# EAGLE schematic zeta2rework_lw_v4 (EAGLE 9.0.1)
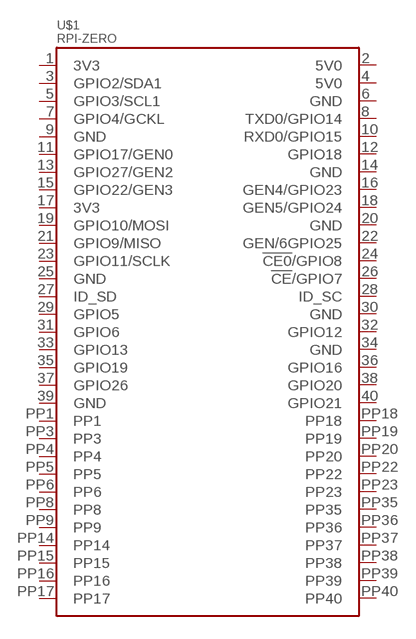
[diagram p0: schematic, sheet 1, part 1 of 2]
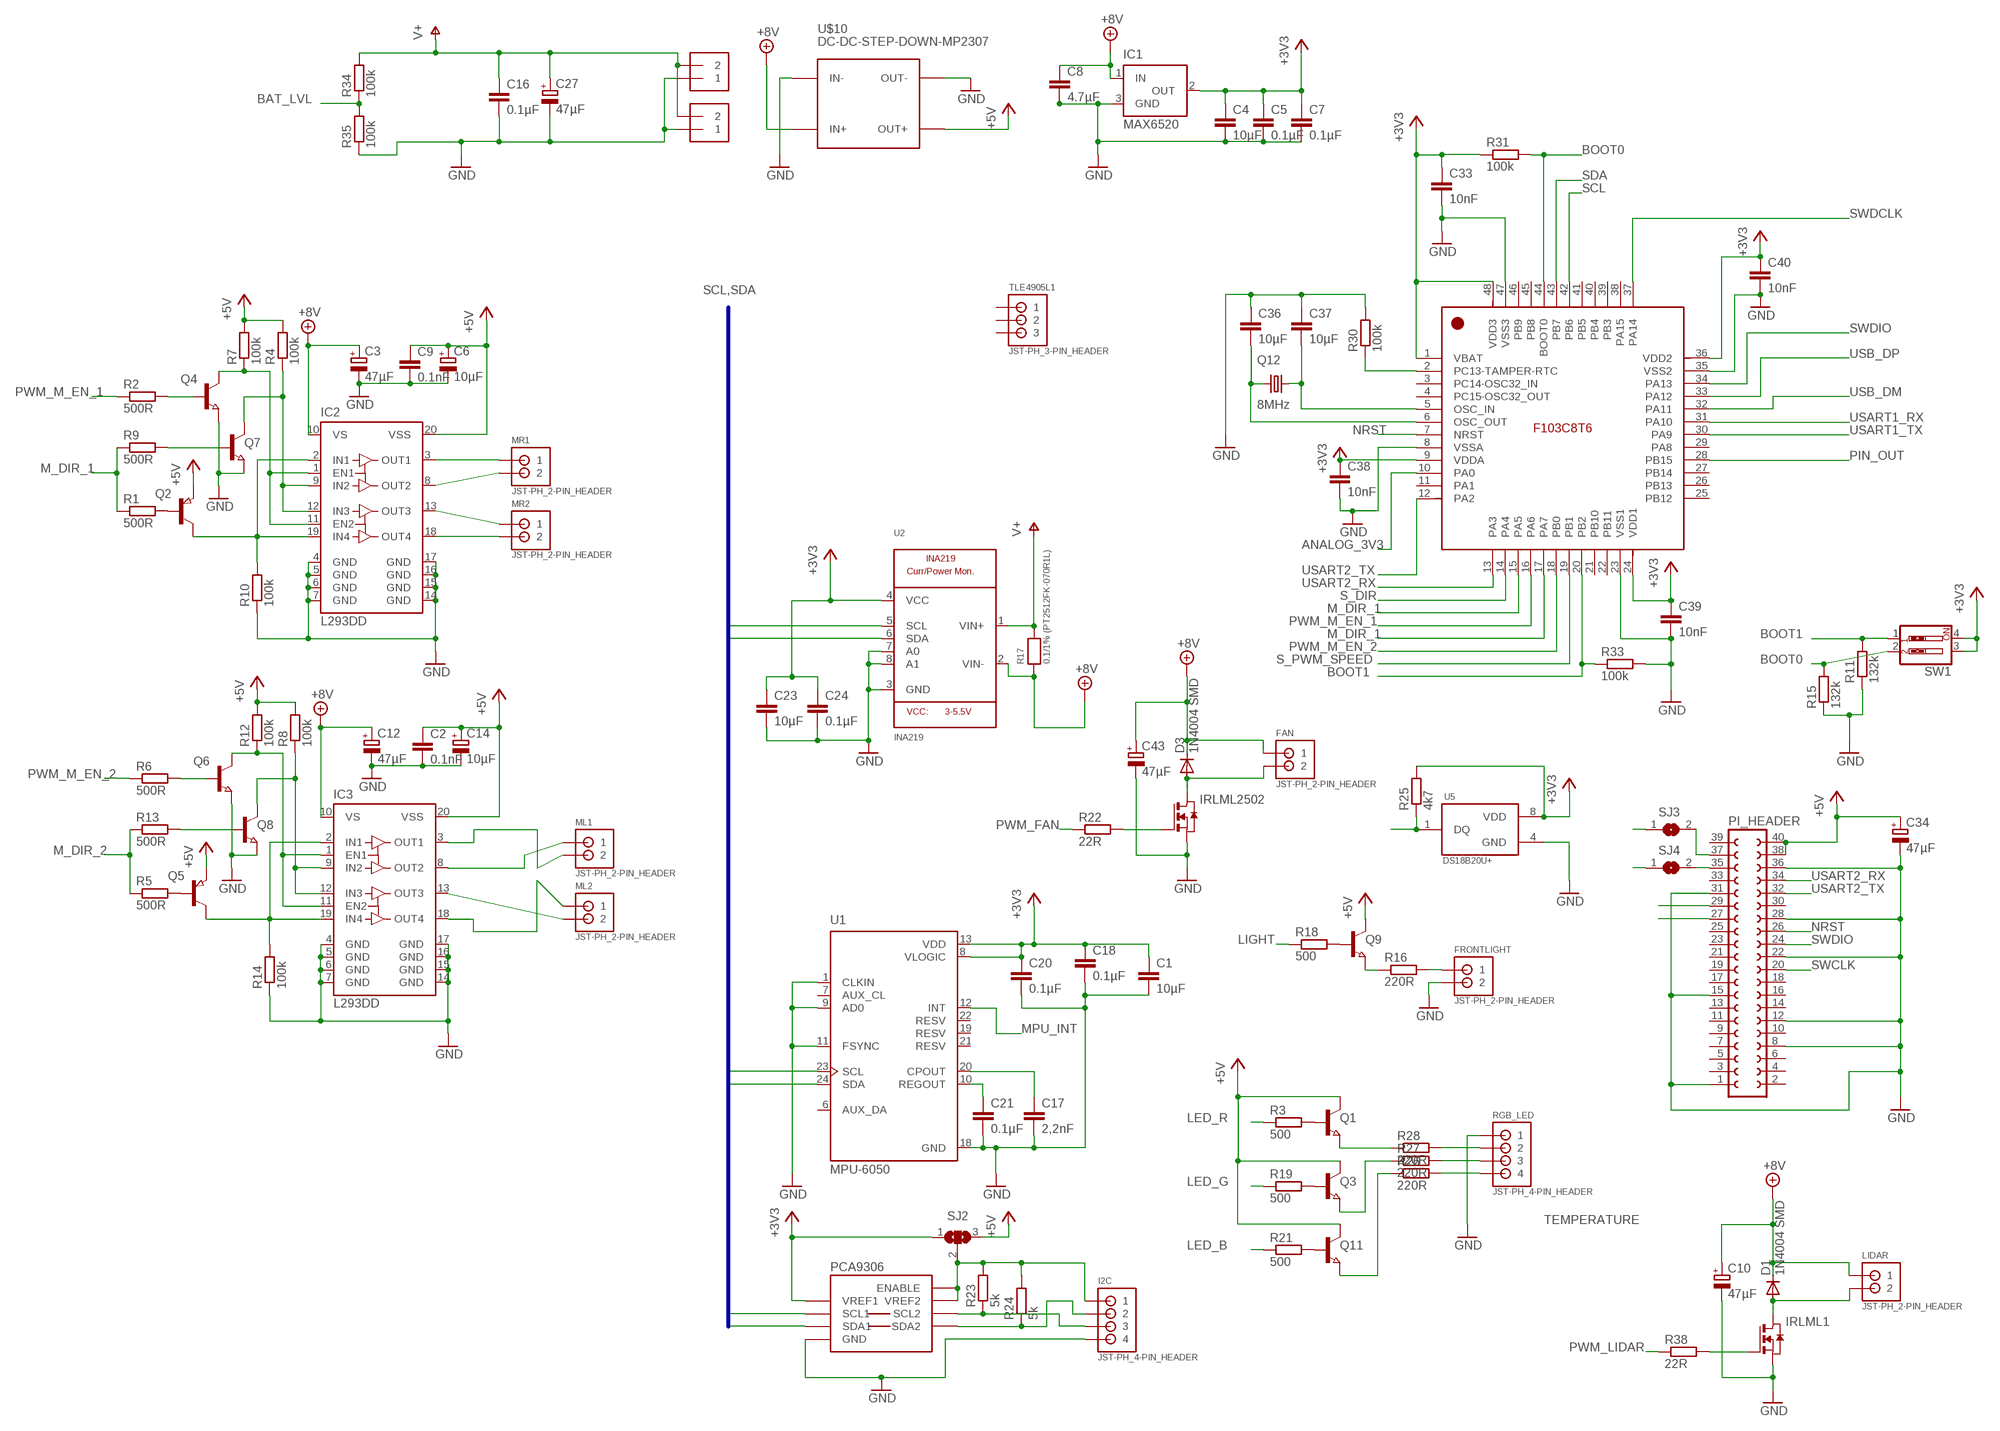
[diagram p1: schematic, sheet 1, part 2 of 2]

## Parts
C1  10µF  C-EUC1206  [C1206]
C2  0.1nF  C-EUC1206  [C1206]
C3  47µF  CPOL-EUUD-4X5,8  [UD-4X5,8_NICHICON]
C4  10µF  C-EUC1206  [C1206]
C5  0.1µF  C-EUC1206  [C1206]
C6  10µF  CPOL-EUUD-4X5,8  [UD-4X5,8_NICHICON]
C7  0.1µF  C-EUC1206  [C1206]
C8  4.7µF  C-EUC1206  [C1206]
C9  0.1nF  C-EUC1206  [C1206]
C10  47µF  CPOL-EUUD-4X5,8  [UD-4X5,8_NICHICON]
C12  47µF  CPOL-EUUD-4X5,8  [UD-4X5,8_NICHICON]
C14  10µF  CPOL-EUUD-4X5,8  [UD-4X5,8_NICHICON]
C16  0.1µF  C-EUC1206  [C1206]
C17  2,2nF  C-EUC1206  [C1206]
C18  0.1µF  C-EUC1206  [C1206]
C20  0.1µF  C-EUC1206  [C1206]
C21  0.1µF  C-EUC1206  [C1206]
C23  10µF  C-EUC1206  [C1206]
C24  0.1µF  C-EUC1206  [C1206]
C27  47µF  CPOL-EUUD-4X5,8  [UD-4X5,8_NICHICON]
C33  10nF  C-EUC1206  [C1206]
C34  47µF  CPOL-EUUD-4X5,8  [UD-4X5,8_NICHICON]
C36  10µF  C-EUC1206  [C1206]
C37  10µF  C-EUC1206  [C1206]
C38  10nF  C-EUC1206  [C1206]
C39  10nF  C-EUC1206  [C1206]
C40  10nF  C-EUC1206  [C1206]
C43  47µF  CPOL-EUUD-4X5,8  [UD-4X5,8_NICHICON]
D1  1N4004 SMD  DIODE-MELF-MLL41  [MELF-MLL41]
D3  1N4004 SMD  DIODE-MELF-MLL41  [MELF-MLL41]
FAN  JST-PH_2-PIN_HEADER  [JST_B2B-PH_HEADER]
FRONTLIGHT  JST-PH_2-PIN_HEADER  [JST_B2B-PH_HEADER]
I2C  JST-PH_4-PIN_HEADER  [JST_B4B-PH_HEADER]
IC1  MAX6520  [SOT23]
IC2  L293DD  [SO20]
IC3  L293DD  [SO20]
IRLML1  NMOSSOT23  [SOT-23]
IRLML2502  NMOSSOT23  [SOT-23]
LIDAR  JST-PH_2-PIN_HEADER  [JST_B2B-PH_HEADER]
ML1  JST-PH_2-PIN_HEADER  [JST_B2B-PH_HEADER]
ML2  JST-PH_2-PIN_HEADER  [JST_B2B-PH_HEADER]
MR1  JST-PH_2-PIN_HEADER  [JST_B2B-PH_HEADER]
MR2  JST-PH_2-PIN_HEADER  [JST_B2B-PH_HEADER]
PCA9306  IC2_LEVEL_TRANSLATER  [SOIC-8]
PI_HEADER  FE20-2  [FE20-2]
Q1  NPN-TRANSISTOR_SOT23  [SOT23]
Q2  PNP-TRANSISTOR_SOT23  [SOT23]
Q3  NPN-TRANSISTOR_SOT23  [SOT23]
Q4  NPN-TRANSISTOR_SOT23  [SOT23]
Q5  PNP-TRANSISTOR_SOT23  [SOT23]
Q6  NPN-TRANSISTOR_SOT23  [SOT23]
Q7  NPN-TRANSISTOR_SOT23  [SOT23]
Q8  NPN-TRANSISTOR_SOT23  [SOT23]
Q9  NPN-TRANSISTOR_SOT23  [SOT23]
Q11  NPN-TRANSISTOR_SOT23  [SOT23]
Q12  8MHz  KX-13  [7.0X5.0]
R1  500R  R-EU_R0603  [R0603]
R2  500R  R-EU_R0603  [R0603]
R3  500  R-EU_R1206  [R1206]
R4  100k  R-EU_R0603  [R0603]
R5  500R  R-EU_R0603  [R0603]
R6  500R  R-EU_R0603  [R0603]
R7  100k  R-EU_R0603  [R0603]
R8  100k  R-EU_R0603  [R0603]
R9  500R  R-EU_R0603  [R0603]
R10  100k  R-EU_R0603  [R0603]
R11  132k  R-EU_R0603  [R0603]
R12  100k  R-EU_R0603  [R0603]
R13  500R  R-EU_R0603  [R0603]
R14  100k  R-EU_R0603  [R0603]
R15  132k  R-EU_R0603  [R0603]
R16  220R  R-EU_R0603  [R0603]
R17  0.1/1% (PT2512FK-070R1L)  RESISTOR2512  [2512]
R18  500  R-EU_R1206  [R1206]
R19  500  R-EU_R1206  [R1206]
R21  500  R-EU_R0603  [R0603]
R22  22R  R-EU_R0603  [R0603]
R23  5k  R-EU_R0603  [R0603]
R24  5k  R-EU_R0603  [R0603]
R25  4k7  R-EU_R0603  [R0603]
R26  220R  R-EU_R0603  [R0603]
R27  220R  R-EU_R0603  [R0603]
R28  220R  R-EU_R0603  [R0603]
R30  100k  R-EU_R0603  [R0603]
R31  100k  R-EU_R0603  [R0603]
R33  100k  R-EU_R0603  [R0603]
R34  100k  R-EU_R0603  [R0603]
R35  100k  R-EU_R0603  [R0603]
R38  22R  R-EU_R0603  [R0603]
RGB_LED  JST-PH_4-PIN_HEADER  [JST_B4B-PH_HEADER]
SJ2  SJ2W  [SJ_2]
SJ3  SOLDERJUMPERREFLOW_NOPASTE  [SOLDERJUMPER_REFLOW_NOPASTE]
SJ4  SOLDERJUMPERREFLOW_NOPASTE  [SOLDERJUMPER_REFLOW_NOPASTE]
SUPPLY_IN  TERMBLOCK_1X2-3.5MM  [1X2-3.5MM]
SUPPLY_IN1  TERMBLOCK_1X2-3.5MM  [1X2-3.5MM]
SW1  SW_DIP-2  [EDG-02]
TLE4905L1  JST-PH_3-PIN_HEADER  [JST_B3B-PH_HEADER]
U1  MPU-6050  [QFN50P400X400X95-24N]
U2  INA219  [SOT23-8]
U5  DS18B20U+  [SOP65P490X95-8N]
U$1  RPI-ZERO  [RASP_PI_ZERO_BOARD_FULL]
U$4  STM32F103C8T6  [LQFP48_7X7MM_0.5MMPP]
U$10  DC-DC-STEP-DOWN-MP2307  [DC-DC-STEP-DOWN-MP2307]

## Nets
+3V3: C1.1 C4.1 C5.1 C7.1 C18.1 C20.1 C23.1 C24.1 C33.1 C38.1 C39.1 C40.1 IC1.2(OUT) PCA9306.1(VREF1) R25.2 R31.1 SJ2.1 SW1.3 SW1.4 U1.8(VLOGIC) U1.13(VDD) U2.4(VCC) U5.8(VDD) U$4.1(VBAT) U$4.9(VDDA) U$4.24(VDD1) U$4.36(VDD2) U$4.48(VDD3)
+5V: C2.1 C6.+ C9.1 C14.+ C34.+ IC2.20(VSS) IC3.20(VSS) PI_HEADER.38 PI_HEADER.40 Q1.3(C) Q2.2(E) Q3.3(C) Q5.2(E) Q9.3(C) Q11.3(C) R4.2 R7.2 R8.2 R12.2 SJ2.3 U$10.OUT+
+8V: C3.+ C8.1 C10.+ C12.+ C43.+ D1.C D3.C FAN.P1 IC1.1(IN) IC2.10(VS) IC3.10(VS) LIDAR.P1 R17.1 U2.2(VIN-) U$10.IN+
ANALOG_3V3: U$4.10(PA0)
BAT_LVL: R34.1 R35.2
BOOT0: R15.2 R31.2 SW1.2 U$4.44(BOOT0)
BOOT1: R11.2 R33.1 SW1.1 U$4.20(PB2)
BOOT2: PI_HEADER.29
BOOT3: PI_HEADER.27
GND: C1.2 C2.2 C3.- C4.2 C5.2 C6.- C7.2 C8.2 C9.2 C10.- C12.- C14.- C16.2 C17.2 C18.2 C20.2 C21.2 C23.2 C24.2 C27.- C33.2 C34.- C36.1 C37.1 C38.2 C39.2 C40.2 C43.- FRONTLIGHT.P2 I2C.P4 IC1.3(GND) IC2.4(GND) IC2.5(GND) IC2.6(GND) IC2.7(GND) IC2.14(GND) IC2.15(GND) IC2.16(GND) IC2.17(GND) IC3.4(GND) IC3.5(GND) IC3.6(GND) IC3.7(GND) IC3.14(GND) IC3.15(GND) IC3.16(GND) IC3.17(GND) IRLML1.2(S) IRLML2502.2(S) PCA9306.4(GND) PI_HEADER.1 PI_HEADER.8 PI_HEADER.12 PI_HEADER.15 PI_HEADER.22 PI_HEADER.28 PI_HEADER.31 PI_HEADER.36 Q4.2(E) Q6.2(E) Q7.2(E) Q8.2(E) R10.1 R11.1 R14.1 R15.1 R30.2 R33.2 R35.1 RGB_LED.P1 SUPPLY_IN1.1 SUPPLY_IN.1 U1.1(CLKIN) U1.9(AD0) U1.11(FSYNC) U1.18(GND) U2.3(GND) U2.7(A0) U2.8(A1) U5.4(GND) U$4.8(VSSA) U$4.23(VSS1) U$4.35(VSS2) U$4.47(VSS3) U$10.IN- U$10.OUT-
LED_B: R21.1
LED_G: R19.1
LED_R: R3.1
LIGHT: R18.1
M_DIR_1: R1.1 R9.1 U$4.15(PA5) U$4.17(PA7)
M_DIR_2: R5.1 R13.1
MPU_INT: U1.12(INT)
N$1: IC2.9(IN2) IC2.12(IN3) Q7.3(C) R4.1
N$2: IC3.18(OUT4) ML2.P1
N$3: IC3.13(OUT3) ML2.P2
N$4: IC2.18(OUT4) MR2.P2
N$5: IC2.2(IN1) IC2.19(IN4) Q2.3(C) R10.2
N$6: IC3.9(IN2) IC3.12(IN3) Q8.3(C) R8.1
N$7: IC3.2(IN1) IC3.19(IN4) Q5.3(C) R14.2
N$8: IC2.1(EN1) IC2.11(EN2) Q4.3(C) R7.1
N$9: IC3.1(EN1) IC3.11(EN2) Q6.3(C) R12.1
N$10: Q2.1(B) R1.2
N$11: Q4.1(B) R2.2
N$12: Q7.1(B) R9.2
N$13: Q5.1(B) R5.2
N$14: Q6.1(B) R6.2
N$15: Q8.1(B) R13.2
N$16: IC2.13(OUT3) MR2.P1
N$17: IC2.8(OUT2) MR1.P2
N$18: IC2.3(OUT1) MR1.P1
N$19: Q9.1(B) R18.2
N$20: Q9.2(E) R16.1
N$21: FRONTLIGHT.P1 R16.2
N$22: Q1.1(B) R3.2
N$23: Q3.1(B) R19.2
N$24: Q1.2(E) R28.1
N$25: IC3.8(OUT2) ML1.P1
N$26: IC3.3(OUT1) ML1.P2
N$28: Q3.2(E) R27.1
N$30: Q11.2(E) R26.1
N$31: R26.2 RGB_LED.P4
N$32: Q11.1(B) R21.2
N$33: R27.2 RGB_LED.P3
N$34: C17.1 U1.20(CPOUT)
N$35: R28.2 RGB_LED.P2
N$36: C21.1 U1.10(REGOUT)
N$37: IRLML2502.3(G) R22.2
N$38: IRLML1.3(G) R38.2
N$39: D1.A IRLML1.1(D) LIDAR.P2
N$41: I2C.P1 PCA9306.7(VREF2) PCA9306.8(ENABLE) R23.2 R24.2 SJ2.2
N$42: I2C.P3 PCA9306.6(SCL2) R23.1
N$43: I2C.P2 PCA9306.5(SDA2) R24.1
N$44: PI_HEADER.37 SJ3.2
N$45: PI_HEADER.35 SJ4.2
N$46: C36.2 Q12.1 U$4.6(OSC_OUT)
N$47: C37.2 Q12.3 U$4.5(OSC_IN)
N$49: R30.1 U$4.2(PC13-TAMPER-RTC)
N$55: D3.A FAN.P2 IRLML2502.1(D)
NRST: PI_HEADER.26 U$4.7(NRST)
PIN_OUT: U$4.28(PB15)
PWM_FAN: R22.1
PWM_LIDAR: R38.1
PWM_M_EN_1: R2.1 U$4.16(PA6)
PWM_M_EN_2: R6.1 U$4.18(PB0)
S_DIR: U$4.14(PA4)
S_PWM_SPEED: U$4.19(PB1)
SCL: U1.23(SCL) U2.5(SCL) U$4.42(PB6)
SCL2: PCA9306.2(SCL1)
SCL3: SJ4.1
SDA: U1.24(SDA) U2.6(SDA) U$4.43(PB7)
SDA2: PCA9306.3(SDA1)
SDA3: SJ3.1
SWCLK: PI_HEADER.20
SWDCLK: U$4.37(PA14)
SWDIO: PI_HEADER.24 U$4.34(PA13)
TEMPERATURE: R25.1 U5.1(DQ)
USART1_RX: U$4.31(PA10)
USART1_TX: U$4.30(PA9)
USART2_RX: PI_HEADER.34 U$4.13(PA3)
USART2_TX: PI_HEADER.32 U$4.12(PA2)
USB_DM: U$4.32(PA11)
USB_DP: U$4.33(PA12)
V+: C16.1 C27.+ R17.2 R34.2 SUPPLY_IN1.2 SUPPLY_IN.2 U2.1(VIN+)
Unconnected: PI_HEADER.2 PI_HEADER.3 PI_HEADER.4 PI_HEADER.5 PI_HEADER.6 PI_HEADER.7 PI_HEADER.9 PI_HEADER.10 PI_HEADER.11 PI_HEADER.13 PI_HEADER.14 PI_HEADER.16 PI_HEADER.17 PI_HEADER.18 PI_HEADER.19 PI_HEADER.21 PI_HEADER.23 PI_HEADER.25 PI_HEADER.30 PI_HEADER.33 PI_HEADER.39 TLE4905L1.P1 TLE4905L1.P2 TLE4905L1.P3 U1.6(AUX_DA) U1.7(AUX_CL) U1.19(RESV) U1.21(RESV) U1.22(RESV) U$1.1(3V3) U$1.2(5V0) U$1.3(GPIO2/SDA1) U$1.4(5V0) U$1.5(GPIO3/SCL1) U$1.6(GND) U$1.7(GPIO4/GCKL) U$1.8(TXD0/GPIO14) U$1.9(GND) U$1.10(RXD0/GPIO15) U$1.11(GPIO17/GEN0) U$1.12(GPIO18) U$1.13(GPIO27/GEN2) U$1.14(GND) U$1.15(GPIO22/GEN3) U$1.16(GEN4/GPIO23) U$1.17(3V3) U$1.18(GEN5/GPIO24) U$1.19(GPIO10/MOSI) U$1.20(GND) U$1.21(GPIO9/MISO) U$1.22(GEN/6GPIO25) U$1.23(GPIO11/SCLK) U$1.24(!CE0!/GPIO8) U$1.25(GND) U$1.26(!CE!/GPIO7) U$1.27(ID_SD) U$1.28(ID_SC) U$1.29(GPIO5) U$1.30(GND) U$1.31(GPIO6) U$1.32(GPIO12) U$1.33(GPIO13) U$1.34(GND) U$1.35(GPIO19) U$1.36(GPIO16) U$1.37(GPIO26) U$1.38(GPIO20) U$1.39(GND) U$1.40(GPIO21) U$1.PP1 U$1.PP3 U$1.PP4 U$1.PP5 U$1.PP6 U$1.PP8 U$1.PP9 U$1.PP14 U$1.PP15 U$1.PP16 U$1.PP17 U$1.PP18 U$1.PP19 U$1.PP20 U$1.PP22 U$1.PP23 U$1.PP35 U$1.PP36 U$1.PP37 U$1.PP38 U$1.PP39 U$1.PP40 U$4.3(PC14-OSC32_IN) U$4.4(PC15-OSC32_OUT) U$4.11(PA1) U$4.21(PB10) U$4.22(PB11) U$4.25(PB12) U$4.26(PB13) U$4.27(PB14) U$4.29(PA8) U$4.38(PA15) U$4.39(PB3) U$4.40(PB4) U$4.41(PB5) U$4.45(PB8) U$4.46(PB9)

## Buses
SCL,SDA

## Library data of the parts
C1 C2 C4 C5 C7-C9 C16-C18 C20 C21 C23 C24 C33 C36-C40 = rcl:C-EU: CAPACITOR, European symbol; SPICEPREFIX: C
C3 C6 C10 C12 C14 C27 C34 C43 = rcl:CPOL-EU: POLARIZED CAPACITOR, European symbol; SPICEPREFIX: C
D1 D3 = diode:DIODE-: DIODE
FAN FRONTLIGHT LIDAR ML1 ML2 MR1 MR2 = srg:JST-PH_2-PIN_HEADER: 2-pin JST PH Shrouded Header, top entry P/N B2B-PH-K-S Mating connector PHR-2 Mating cable assembly: Sparkfun PRT-09914 <http://www.sparkfun.com/products/9914>
I2C RGB_LED = srg:JST-PH_4-PIN_HEADER: 4-pin JST PH Shrouded Header, top entry P/N B4B-PH-K-S Mating connector PHR-4 Mating cable assembly: Sparkfun PRT-09916 <http://www.sparkfun.com/products/9916>
IC1 = maxim:MAX6520: 1.2V Voltage Reference 50ppm/°C, SOT23, 3-Terminal Source: Data sheet <http://datasheets.maxim-ic.com/en/ds/MAX6520.pdf>; MF: MAXIM; MPN: MAX6520EUR-T; OC_FARNELL: unknown; OC_NEWARK: 02J4586
IC2 IC3 = st-microelectronics:L293DD: PUSH-PULL FOUR CHANNEL DRIVER WITH DIODES Source: http://www.st.com/stonline/books/pdf/docs/1330.pdf; OC_FARNELL: unknown
IRLML1 IRLML2502 = zetex:NMOSSOT23: MOS FET; OC_FARNELL: unknown; OC_NEWARK: unknown
PCA9306 = srg:IC2_LEVEL_TRANSLATER: I2C Level Translator PCA9306 Data Sheet <http://www.ti.com/lit/ds/symlink/pca9306.pdf> Sparkfun breakout board schematic <http://dlnmh9ip6v2uc.cloudfront.net/datasheets/BreakoutBoards/PCA9306_Breakout.pdf>
PI_HEADER = con-lsta:FE20-2: FEMALE HEADER; OC_FARNELL: unknown; OC_NEWARK: unknown
Q1 Q3 Q4 Q6-Q9 Q11 = semicon-smd-ipc:NPN-TRANSISTOR_: NPN TRANSISTOR
Q2 Q5 = semicon-smd-ipc:PNP-TRANSISTOR_: PNP TRANSISTOR
Q12 = crystal-geyer_V1_0:KX: Quartz Crystals (MHz) SMD: KX - Serie Model Size l/w/h [mm] Frequency Range Frequency Stability Temp. Range [°C] Load Capacitance AECQ 200 availabel Datasheet KX-4 KX-5 KX-6 KX-7 KX-9A KX-9B KX-12A KX-12B KX-13 KX-20 KX-K KX-KS 1.6/1.2/0.3 2.0/1.6/0.45 2.5/2.0/0.55 3.2/2.5/0.8 5.0/3.2/1.0 5.0/3.2/1.1 6.0/3.5/1.1 6.0/3.5/1.0 7.0/5.0 /1.3 11.6/5.5/1.6 12.3/4.5/4.2 12.3/4.5/3.2 24.0 ~ 80.0 MHz 16.0 ~ 80.0 MHz 12.0 ~ 80.0 MHz 8.0 ~ 60.0 MHz 7,68 ~ 300,0 MHz 8,0 ~ 50,0 MHz 8,0 ~ 150,0 MHz 8,0 ~ 50,0 MHz 6,0 ~ 160,0 MHz 3,579 ~ 25,0 MHz 3,579 ~ 70,0 MHz 3,579 ~ 70,0 MHz ±10 … ±50ppm ±10 … ±50ppm ±10 … ±50ppm ±10 … ±50ppm ±10 … ±50ppm ±10 … ±50ppm ±10 … ±50ppm ±10 … ±50ppm ±10 … ±50ppm ±50ppm ±10 … ±50ppm ±10 … ±50ppm (*) -40°C …+85°C (*) -40°C …+125°C (*) -40°C …+125°C (*) -40°C …+125°C (*) -40°C …+105°C (*) -40°C …+105°C (*) -40°C …+125°C (*) -40°C …+105°C (*) -40°C …+105°C (*) -40°C …+105°C (*) -40°C …+85°C (*) -40°C …+85°C 8, 8…16 8, 8…16 10, 8…16 12, 7…20 16, 10…20 16, 10…20 16, 10…20 16, 12…20 16, 12…20 16, 12…20 16, 12…30 16, 12…30 - yes yes yes - - - - - - - - KX-4.pdf <http://www.geyer-electronic.de/uploads/tx_userartikelfrequenz/GEYER-KX-4.pdf> KX-5.pdf <http://www.geyer-electronic.de/uploads/tx_userartikelfrequenz/GEYER-KX-5.pdf> KX-6.pdf <http://www.geyer-electronic.de/uploads/tx_userartikelfrequenz/GEYER-KX-6.pdf> KX-7.pdf <http://www.geyer-electronic.de/uploads/tx_userartikelfrequenz/GEYER-KX-7.pdf> KX-9A.pdf <http://www.geyer-electronic.de/uploads/tx_userartikelfrequenz/GEYER-KX-9A.pdf> KX-9B.pdf <http://www.geyer-electronic.de/uploads/tx_userartikelfrequenz/GEYER-KX-9B.pdf> KX-12A.pdf <http://www.geyer-electronic.de/uploads/tx_userartikelfrequenz/GEYER-KX-12A.pdf> KX-12B.pdf <http://www.geyer-electronic.de/uploads/tx_userartikelfrequenz/GEYER-KX-12B.pdf> KX-13.pdf <http://www.geyer-electronic.de/uploads/tx_userartikelfrequenz/GEYER-KX-13.pdf> KX-20.pdf <http://www.geyer-electronic.de/uploads/tx_userartikelfrequenz/GEYER-KX-20.pdf> KX-K.pdf <http://www.geyer-electronic.de/uploads/tx_userartikelfrequenz/GEYER-KX-K.pdf> KX-KS.pdf <http://www.geyer-electronic.de/uploads/tx_userartikelfrequenz/GEYER-KX-KS.pdf> <http://www.geyer-electronic.de/fileadmin/template/img/logo-geyer-electronic.png> Details see: http://www.geyer-electronic.de/Frequenz-Produkte.9.0.html Created 2016-06-07, Hans Locher 2016 (C) Geyer Quartz Technology KX4,KX5,KX6,KX7,KX9A,KX9B,KX12A,KX12B,KX13,KX20,KXK,KXKS;1612;2016;2520;3225;5032;6035;7050;11655;12345;1,6x1,2;2,0x1,6;2,5x2,0;3,2x2,5;5,0x3,2;6,0x3,5;7,0x5,0;11,6x5,5;12,3x4,5;12,3x4,5;1.6x1.2;2.0x1.6;2.5x2.0;3.2x2.5;5.0x3.2;6.0x3.5;7.0x5.0;11.6x5.5;12.3x4.5;12.3x4.5;
R1-R16 R18 R19 R21-R28 R30 R31 R33-R35 R38 = rcl:R-EU_: RESISTOR, European symbol; SPICEPREFIX: R
R17 = microbuilder:RESISTOR: Resistors 0402 - 0402 Surface Mount Package 22 Ohm 1% 1/16W [Digikey: 311-22.0LRTR-ND] 33 Ohm 5% 1/16W 1.0K 5% 1/16W 1.5K 5% 1/16W 2.0K 1% 1/16W 10.0K 1% 1/16W [Digikey: 311-10.0KLRTR-ND] 10.0K 5% 1/16W [Digikey: RMCF0402JT10K0TR-ND] 12.1K 1% 1/16W [Digikey: 311-22.0LRTR-ND] 100.0K 5% 1/16W 0603 - 0603 Surface Mount Package 0 Ohm 1/10 Watt 1% Resistor 15 Ohm 1/10 Watt 1% Resistor 33 Ohm 1/10 Watt 1% Resistor 49.9 Ohm 1/10 Watt 1% Resistor 100 Ohm 1/10 Watt 1% Resistor 150 Ohm 1/10 Watt 1% Resistor 240 Ohm 1/10 Watt 1% Resistor 390 Ohm 1/10 Watt 1% Resistor 560 Ohm 1/10 Watt 1% Resistor 680 Ohm 1/10 Watt 1% Resistor 750 Ohm 1/10 Watt 1% Resistor 1.0K Ohm 1/10 Watt 1% Resistor 1.5K Ohm 1/10 Watt 1% Resistor 2.0K Ohm 1/10 Watt 1% Resistor 2.2K Ohm 1/10 Watt 1% Resistor 3.3K Ohm 1/10 Watt 1% Resistor 4.7K Ohm 1/10 Watt 1% Resistor 10.0K Ohm 1/10 Watt 1% Resistor 12.0K Ohm 1/10 Watt 1% Resistor 12.1K Ohm 1/10 Watt 1% Resistor 20.0K Ohm 1/10 Watt 1% Resistor 33.0K Ohm 1/10 Watt 1% Resistor 100.0K Ohm 1/10 Watt 1% Resistor 0805 - 0805 Surface Mount Package 0 Ohm 1/8 Watt 1% Resistor 33 Ohm 1/8 Watt 1% Resistor 100 Ohm 1/8 Watt 1% Resistor 150 Ohm 1/8 Watt 1% Resistor 200 Ohm 1/8 Watt 1% Resistor 240 Ohm 1/8 Watt 1% Resistor 330 Ohm 1/8 Watt 1% Resistor 390 Ohm 1/8 Watt 1% Resistor 470 Ohm 1/8 Watt 1% Resistor 1.0K Ohm 1/8 Watt 1% Resistor 1.5K Ohm 1/8 Watt 1% Resistor 2.0K Ohm 1/8 Watt 1% Resistor 4.7K Ohm 1/8 Watt 1% Resistor 5.1K Ohm 1/8 Watt 1% Resistor 5.6K Ohm 1/8 Watt 1% Resistor 10.0K Ohm 1/8 Watt 1% Resistor 22.0K Ohm 1/8 Watt 1% Resistor 33.0K Ohm 1/8 Watt 1% Resistor 100K Ohm 1/8 Watt 1% Resistor 1206 - 1206 Surface Mount Package 2012 - 2010 Surface Mount Package 0.11 Ohm 1/2 Watt 1% Resistor - Digikey: RHM.11UCT-ND
SJ2 = jumper:SJ2W: SMD solder JUMPER
SJ3 SJ4 = microbuilder:SOLDERJUMPER: SMD Solder JUMPER Solder the two pads together to create a connection, or remove the solder to break it. REFLOW - Use this footprint for solder paste and reflow ovens. WAVE - Use this footprint for hand-soldering (larger pads). CLOSED - Has a trace between the two pads to ensure it is closed by default. The trace needs to be cut to disable the jumper, and can be closed again by creating a solder bridge between the two pads.
SUPPLY_IN SUPPLY_IN1 = microbuilder:TERMBLOCK_1X2: 3.5mm Terminal block http://www.ladyada.net/library/pcb/eaglelibrary.html
SW1 = special:SW_DIP-2: DIP SWITCH
TLE4905L1 = srg:JST-PH_3-PIN_HEADER: 3-pin JST PH Shrouded Header, top entry P/N B3B-PH-K-S Mating connector PHR-3
U1 = MPU-6050:MPU-6050: MPU-6050 Six-Axis (Gyro + Accelerometer) MEMS MotionTracking™ Devices; AVAILABILITY: Good; DESCRIPTION: 3-axis gyroscope, 3-axis accelerometer in a 4x4x0.9 housing; MF: TDK; MP: MPU-6050; PACKAGE: QFN-24 InvenSense; PRICE: 5.12 USD
U2 = INA219:INA219: INA219 - I2C Current/Power Monitor Voltage Range: 0-26V Accuracy: 0.5% Temperature: -40°C - 125°C; AVAILABILITY: Unavailable; DESCRIPTION: the ina219 is a high-side current shunt and power monitor with an i2c interface. the ina219 monitors both shunt drop ...; MF: Texas Instruments; MP: INA219; PACKAGE: None; PRICE: None
U5 = DS18B20U_:DS18B20U+: Board Mount Temperature Sensors Prgmble Resolution 1-Wire Parasite Pwr; AVAILABILITY: Unavailable; DESCRIPTION: Date Code: 1043+; RoHS Compliant: Yes;; MF: Maxim; MP: DS18B20U+; PACKAGE: TSSOP-8 Chip Coolers; PRICE: None
U$1 = rpi-zero:RPI-ZERO
U$4 = STM32F103C8T6:STM32F103C8T6; AVAILABILITY: Good; DESCRIPTION: Mainstream Performance line, ARM Cortex-M3 MCU with 64 Kbytes Flash, 72 MHz CPU, motor control, USB and CAN; MF: STMicroelectronics; MP: STM32F103C8T6; PACKAGE: LQFP-48 STMicroelectronics; PRICE: 3.83 USD
U$10 = diy-modules:DC-DC-STEP-DOWN-MP2307: DC/DC Step-Down Regulator based on MP2307DN chip MP2307 datasheet available here: https://cdn-shop.adafruit.com/datasheets/MP2307_r1.9.pdf Click here to find device on ebay.com <http://www.ebay.com/sch/dc+dc+3a+mini+converter>